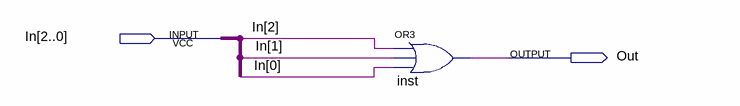
[diagram p0: schematic sheet]
// Quartus schematic or3_bus.bdf as structural Verilog: 1 symbols, 2 pins
module or3_bus (
  input  [2:0] In,
  output Out
);

  or inst (Out, In[2], In[1], In[0]);
endmodule
